# EAGLE design iya ini pcb cetaknya (EAGLE 9.6.2)
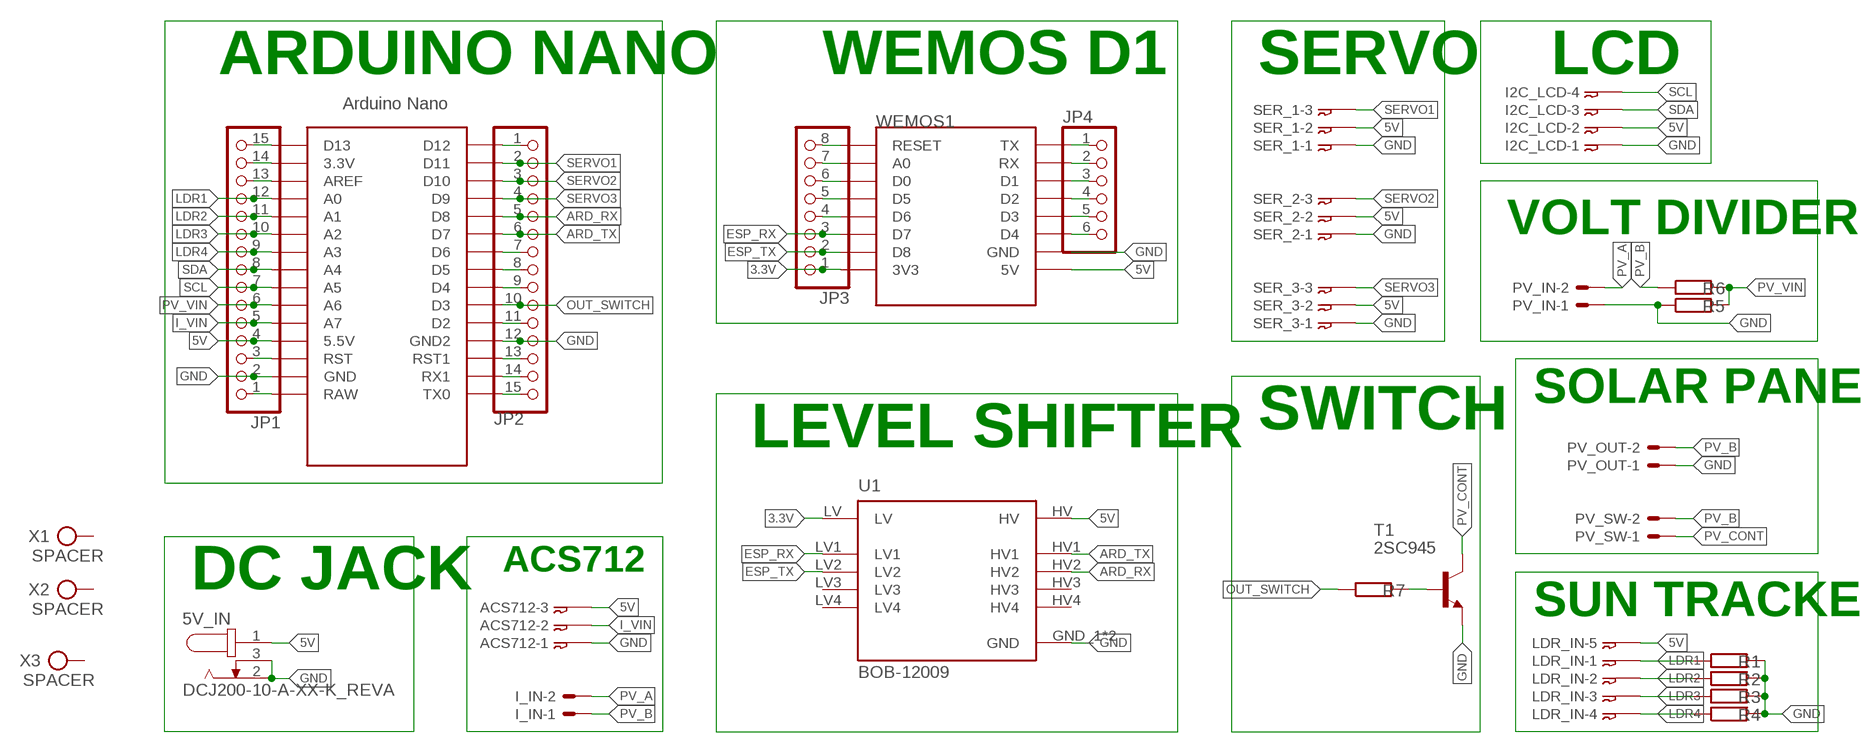
[diagram p0: schematic, sheet 1]

## Parts
5V_IN  DCJ200-10-A-XX-K_REVA  [GCT_DCJ200-10-A-XX-K_REVA]
ACS712  03-JST-B3B-XH-A  [B3B-XH]
I2C_LCD  04-JST-B4B-XH-A  [B4B-XH]
I_IN  MOLEX_2P_27-2021  [6410-02]
JP1  PINHD-1X15  [1X15]
JP2  PINHD-1X15  [1X15]
JP3  PINHD-1X8  [1X08]
JP4  PINHD-1X6  [1X06]
LDR_IN  05-JST-B5B-XH-A  [B5B-XH]
PV_IN  MOLEX_2P_27-2021  [6410-02]
PV_OUT  MOLEX_2P_27-2021  [6410-02]
PV_SW  MOLEX_2P_27-2021  [6410-02]
R1  R-EU_0207/2V  [0207/2V]
R2  R-EU_0207/2V  [0207/2V]
R3  R-EU_0207/2V  [0207/2V]
R4  R-EU_0207/2V  [0207/2V]
R5  R-EU_0207/10  [0207/10]
R6  R-EU_0207/10  [0207/10]
R7  R-EU_0207/10  [0207/10]
SER_1  03-JST-B3B-XH-A  [B3B-XH]
SER_2  03-JST-B3B-XH-A  [B3B-XH]
SER_3  03-JST-B3B-XH-A  [B3B-XH]
T1  2SC945  [TO92-ECB]
U1  BOB-12009  [CONV_BOB-12009]
U$1  NANO  [NANO]
WEMOS1  WEMOS-D1-MINI  [WEMOS-D1-MINI]
X1  SPACER  [SPACER]
X2  SPACER  [SPACER]
X3  SPACER  [SPACER]

## Nets
3.3V: JP3.1 U1.LV WEMOS1.3V3
5V: 5V_IN.1 ACS712.P$3 I2C_LCD.P$2 JP1.4 LDR_IN.P$5 SER_1.P$2 SER_2.P$2 SER_3.P$2 U1.HV U$1.5V(5.5V) WEMOS1.5V
ARD_RX: JP2.5 U1.HV2 U$1.D8
ARD_TX: JP2.6 U1.HV1 U$1.D7
ESP_RX: JP3.3 U1.LV1 WEMOS1.D7
ESP_TX: JP3.2 U1.LV2 WEMOS1.D8
GND: 5V_IN.2 5V_IN.3 ACS712.P$1 I2C_LCD.P$1 JP1.2 JP2.12 PV_IN.1 PV_OUT.1 R1.2 R2.2 R3.2 R4.2 R5.1 SER_1.P$1 SER_2.P$1 SER_3.P$1 T1.E U1.GND_1(GND) U1.GND_2(GND) U$1.GND U$1.GND1(GND2) WEMOS1.GND
I_VIN: ACS712.P$2 JP1.5 U$1.A7
LDR1: JP1.12 LDR_IN.P$1 R1.1 U$1.A0
LDR2: JP1.11 LDR_IN.P$2 R2.1 U$1.A1
LDR3: JP1.10 LDR_IN.P$3 R3.1 U$1.A2
LDR4: JP1.9 LDR_IN.P$4 R4.1 U$1.A3
N$1: JP2.7 U$1.D6
N$3: R7.2 T1.B
N$5: JP2.1 U$1.D12
N$8: JP3.8 WEMOS1.RESET
N$9: JP3.7 WEMOS1.A0
N$10: JP2.8 U$1.D5
N$11: JP2.9 U$1.D4
N$13: JP3.6 WEMOS1.D0
N$14: JP2.11 U$1.D2
N$15: JP3.5 WEMOS1.D5
N$16: JP2.13 U$1.RST1
N$17: JP2.14 U$1.RX1
N$18: JP2.15 U$1.TX0
N$19: JP1.1 U$1.RAW
N$20: JP1.3 U$1.RST
N$21: JP3.4 WEMOS1.D6
N$24: JP1.13 U$1.AREF
N$25: JP1.14 U$1.3.3V
N$26: JP1.15 U$1.D13
N$29: JP4.6 WEMOS1.D4
N$30: JP4.5 WEMOS1.D3
N$31: JP4.4 WEMOS1.D2
N$32: JP4.3 WEMOS1.D1
N$33: JP4.2 WEMOS1.RX
N$34: JP4.1 WEMOS1.TX
OUT_SWITCH: JP2.10 R7.1 U$1.D3
PV_A: I_IN.2 PV_IN.2
PV_B: I_IN.1 PV_OUT.2 PV_SW.2 R6.1
PV_CONT: PV_SW.1 T1.C
PV_VIN: JP1.6 R5.2 R6.2 U$1.A6
SCL: I2C_LCD.P$4 JP1.7 U$1.A5
SDA: I2C_LCD.P$3 JP1.8 U$1.A4
SERVO1: JP2.2 SER_1.P$3 U$1.D11
SERVO2: JP2.3 SER_2.P$3 U$1.D10
SERVO3: JP2.4 SER_3.P$3 U$1.D9
Unconnected: U1.HV3 U1.HV4 U1.LV3 U1.LV4 U$1.ICSP1 U$1.ICSP2 U$1.ICSP3 U$1.ICSP4 U$1.ICSP5 U$1.ICSP6 X1.X X2.X X3.X

## Notes on the sheet
- ARDUINO NANO | WEMOS D1 | SERVO | LCD
- VOLT DIVIDER
- SOLAR PANEL
- LEVEL SHIFTER | SWITCH
- ACS712
- DC JACK
- SUN TRACKER

## Library data of the parts
5V_IN = DCJ200-10-A-XX-K_REVA:DCJ200-10-A-XX-K_REVA: Check availability <https://pricing.snapeda.com/parts/DCJ200-10-A-K1-K/Global%20Connector%20Technology/view-part?ref=eda>; AVAILABILITY: In Stock; CHECK_PRICES: https://www.snapeda.com/parts/DCJ200-10-A-K1-K/Global+Connector+Technology/view-part/?ref=eda; DESCRIPTION: Power Barrel Connector Jack 2.05mm ID (0.081), 5.50mm OD (0.217) Through Hole, Right Angle; MF: Global Connector Technology; MP: DCJ200-10-A-K1-K; PACKAGE: None; PRICE: None; SNAPEDA_LINK: https://www.snapeda.com/parts/DCJ200-10-A-K1-K/Global+Connector+Technology/view-part/?ref=snap
ACS712 SER_1-SER_3 = bt_con-jst-xh:03-JST: JST CONNECTOR
I2C_LCD = bt_con-jst-xh:04-JST: JST CONNECTOR
I_IN PV_IN PV_OUT PV_SW = 1_Polirevo24_PelatihanElektronika:MOLEX_2P_: MOLEX 2P - POLIREVO24; MF: MOLEX; OC_FARNELL: unknown; OC_NEWARK: unknown
JP1 JP2 = pinhead:PINHD-1X15: PIN HEADER
JP3 = pinhead:PINHD-1X8: PIN HEADER
JP4 = pinhead:PINHD-1X6: PIN HEADER
LDR_IN = bt_con-jst-xh:05-JST: JST CONNECTOR
R1-R7 = resistor:R-EU_: RESISTOR, European symbol
T1 = transistor:2SC945: NPN Silicon Epitaxial Planar Transistor Source: SEMTECH ELECTRONICS LTD. ... 2SC945 2.pdf
U1 = BOB-12009:BOB-12009: Check availability <https://pricing.snapeda.com/parts/BOB-12009/SparkFun/view-part?ref=eda>; AVAILABILITY: In Stock; CHECK_PRICES: https://www.snapeda.com/parts/BOB-12009/SparkFun/view-part/?ref=eda; DESCRIPTION: BSS138 - Logic-Level Translator Interface Evaluation Board; MF: SparkFun; MP: BOB-12009; PACKAGE: None; PRICE: None; SNAPEDA_LINK: https://www.snapeda.com/parts/BOB-12009/SparkFun/view-part/?ref=snap
U$1 = Arduino-clone:NANO: Arduino Nano
WEMOS1 = Eagle Mixed Library:WEMOS-D1-MINI: WeMos.cc D1 mini ESP8266 module
X1-X3 = LIBRARY PHD SELEKDA:SPACER: Spacer PCB

## Board
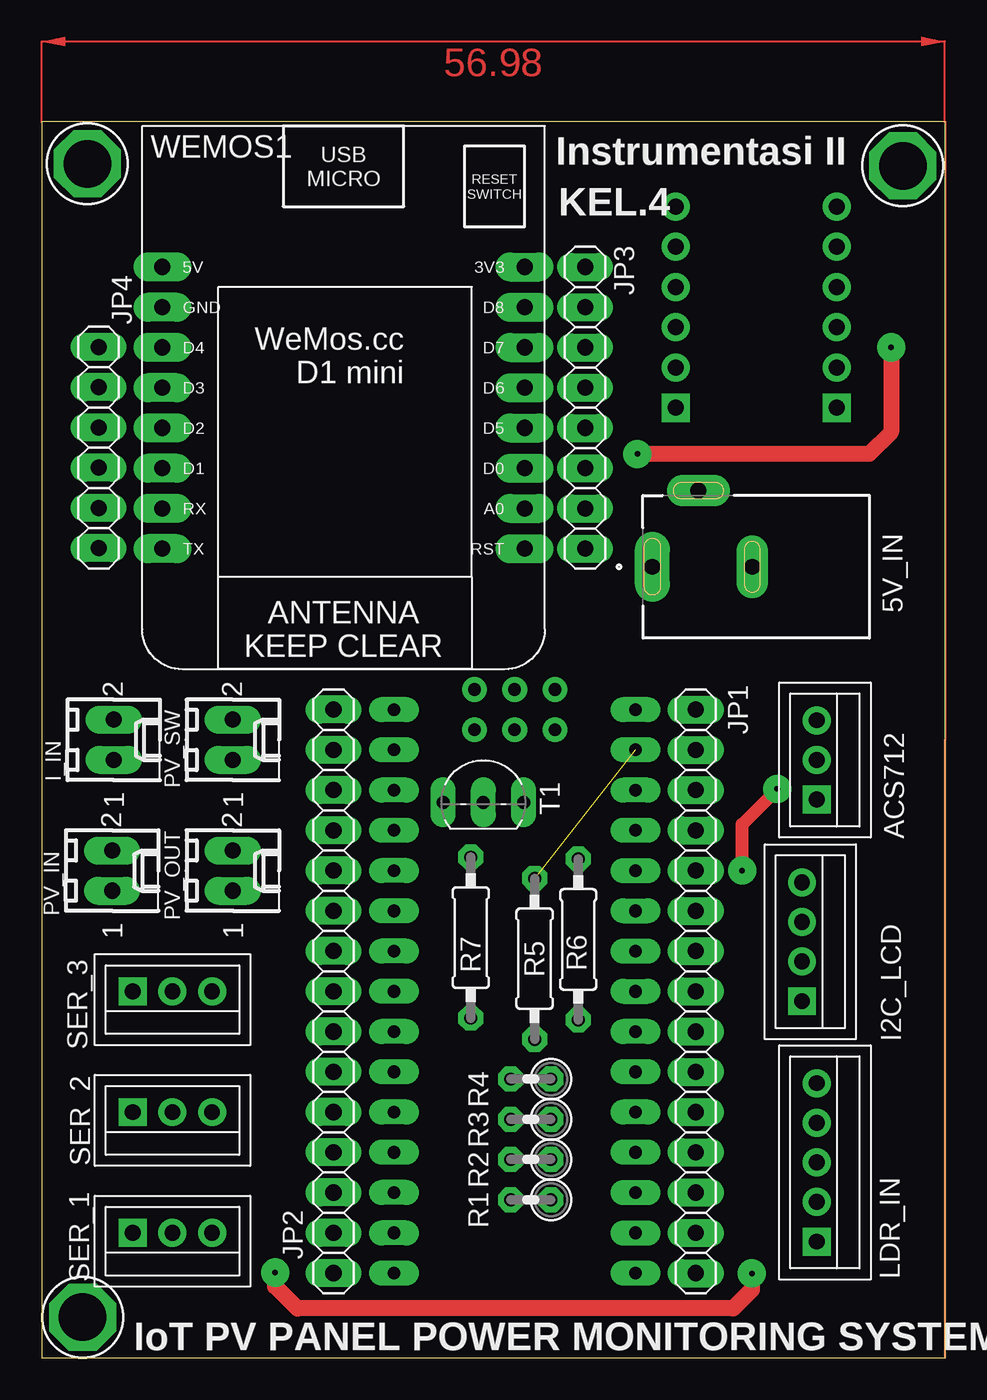
[diagram p1: board, top side]
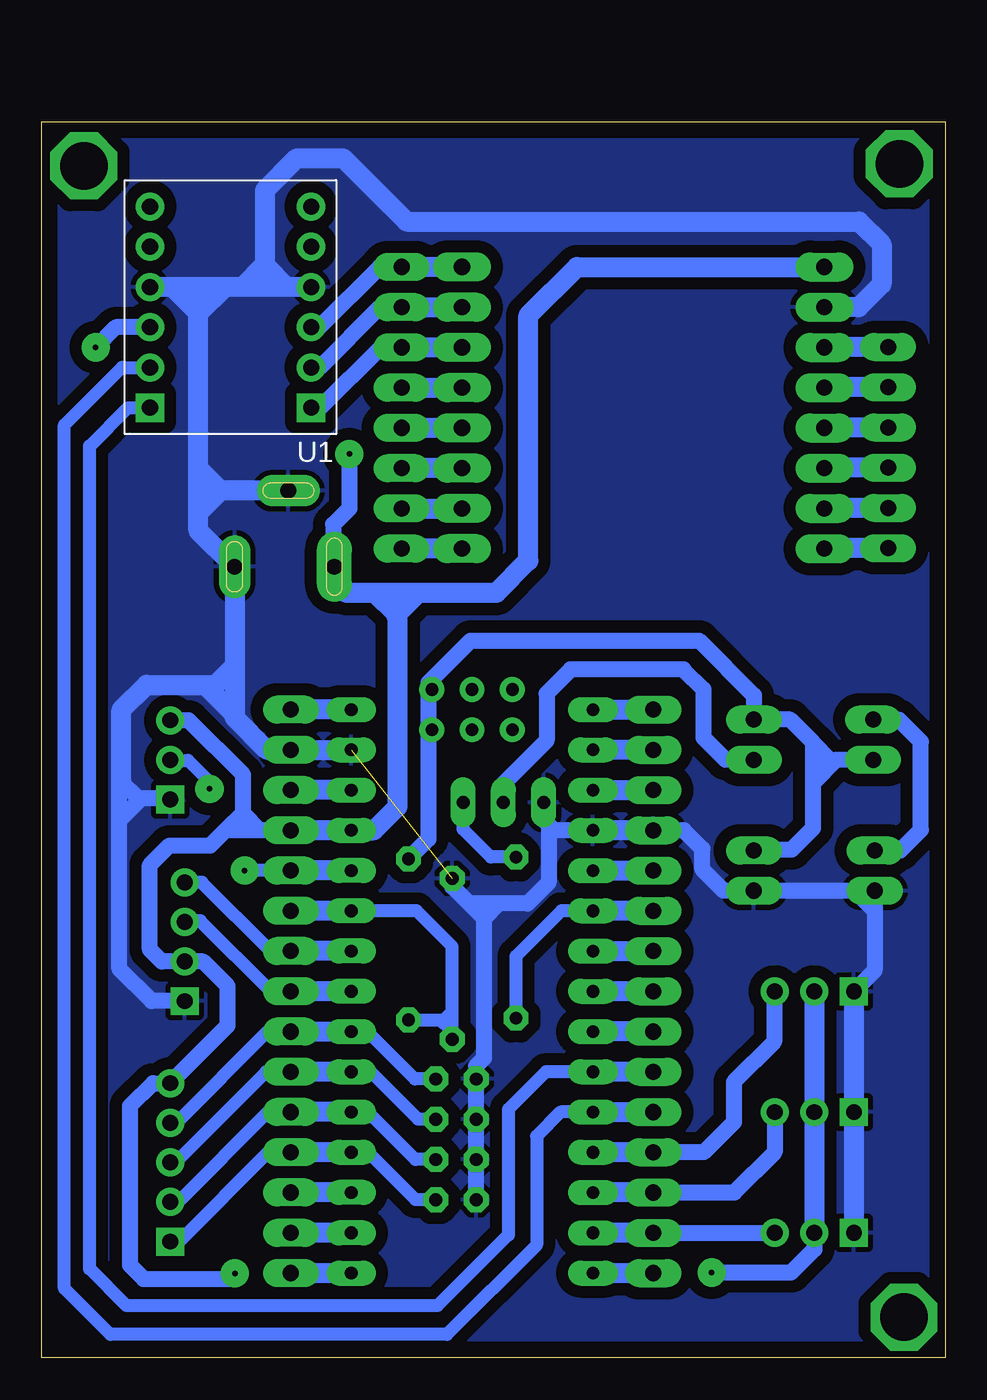
[diagram p2: board, bottom side, seen from below]

Size 57 x 78 mm. Coordinates in mm from the lower left corner, seen from the top.
Outline: 0,0 57,0 57,78 0,78 0,0
Copper layers (1*16): Top 0.035mm / dielectric 1.5mm / Bottom 0.035mm
Design rules "default *": minimum track width 6mil, minimum drill 0.35mm, track to track 30mil, track to pad 28mil, pad to pad 28mil, via to via 28mil, smd to smd 13mil, copper to edge 40mil, drill to drill 6mil, minimum pad ring 15mil, minimum via ring 28mil, stop-mask expansion 4mil, vias tented up to drill 0mil, thermal gap 13mil

### Footprints (pad centres in the part's own frame; a part is rotated, then mirrored left to right if it is on the bottom)
GCT_DCJ200-10-A-XX-K_REVA = drill 1 pad 2.2 long: 1 0,6.55 | drill 1 pad 2 long: 2 0,0.25; 3 4.8,3.65
B3B-XH = drill 1 square: P$1 2.5,0 | drill 1: P$2 0,0; P$3 -2.5,0
B4B-XH = drill 1 square: P$1 3.75,0 | drill 1: P$2 1.25,0; P$3 -1.25,0; P$4 -3.75,0
6410-02 = drill 1.016 long: 1 1.27,0; 2 -1.27,0
1X15 = drill 1.016 long: 1 -17.78,0; 2 -15.24,0; 3 -12.7,0; 4 -10.16,0; 5 -7.62,0; 6 -5.08,0; 7 -2.54,0; 8 0,0; 9 2.54,0; 10 5.08,0; 11 7.62,0; 12 10.16,0; 13 12.7,0; 14 15.24,0; 15 17.78,0
1X08 = drill 1.016 long: 1 -8.89,0; 2 -6.35,0; 3 -3.81,0; 4 -1.27,0; 5 1.27,0; 6 3.81,0; 7 6.35,0; 8 8.89,0
1X06 = drill 1.016 long: 1 -6.35,0; 2 -3.81,0; 3 -1.27,0; 4 1.27,0; 5 3.81,0; 6 6.35,0
B5B-XH = drill 1 square: P$1 5,0 | drill 1: P$2 2.5,0; P$3 0,0; P$4 -2.5,0; P$5 -5,0
0207/2V = drill 0.813 octagon: 1 -1.27,0; 2 1.27,0
0207/10 = drill 0.813 octagon: 1 -5.08,0; 2 5.08,0
TO92-ECB = drill 0.813 long: B 2.54,0; C 0,0; E -2.54,0
CONV_BOB-12009 = drill 1.016: GND_1 5.08,-1.27; GND_2 -5.08,-1.27; HV 5.08,1.27; HV2 5.08,3.81; HV3 5.08,-3.81; HV4 5.08,-6.35; LV -5.08,1.27; LV2 -5.08,3.81; LV3 -5.08,-3.81; LV4 -5.08,-6.35 | drill 1.016 square: HV1 5.08,6.35; LV1 -5.08,6.35
NANO = drill 0.8 long: 3.3V -10.16,24.13; 5V -10.16,-1.27; A0 -10.16,19.05; A1 -10.16,16.51; A2 -10.16,13.97; A3 -10.16,11.43; A4 -10.16,8.89; A5 -10.16,6.35; A6 -10.16,3.81; A7 -10.16,1.27; AREF -10.16,21.59; D2 5.08,1.27; D3 5.08,3.81; D4 5.08,6.35; D5 5.08,8.89; D6 5.08,11.43; D7 5.08,13.97; D8 5.08,16.51; D9 5.08,19.05; D10 5.08,21.59; D11 5.08,24.13; D12 5.08,26.67; D13 -10.16,26.67; GND -10.16,-6.35; GND1 5.08,-1.27; RAW -10.16,-8.89; RST -10.16,-3.81; RST1 5.08,-3.81; RX1 5.08,-6.35; TX0 5.08,-8.89 | drill 0.8: ICSP1 -5.08,-10.16; ICSP2 -5.08,-7.62; ICSP3 -2.54,-10.16; ICSP4 -2.54,-7.62; ICSP5 0,-10.16; ICSP6 0,-7.62
WEMOS-D1-MINI = drill 1.016 pad 1.829 long: 3V3 -10.16,-10.16; 5V 12.7,-10.16; A0 -10.16,5.08; D0 -10.16,2.54; D1 12.7,2.54; D2 12.7,0; D3 12.7,-2.54; D4 12.7,-5.08; D5 -10.16,0; D6 -10.16,-2.54; D7 -10.16,-5.08; D8 -10.16,-7.62; GND 12.7,-7.62; RESET -10.16,7.62; RX 12.7,5.08; TX 12.7,7.62
SPACER = drill 3 pad 4 octagon: X 0,0

### Placement (x,y rotation side)
5V_IN  45.09,49.93 90 top
ACS712  48.9,37.73 270 top
I2C_LCD  47.97,26.26 270 top
I_IN  4.55,39.01 270 top
JP1  41.27,23.13 270 top
JP2  18.41,23.13 90 top
JP3  34.29,59.96 270 top
JP4  3.6,57.45 90 top
LDR_IN  48.9,12.34 270 top
PV_IN  4.45,30.75 270 top
PV_OUT  12.06,30.75 270 top
PV_SW  12.06,39.01 270 top
R1  30.86,9.97 180 top
R2  30.86,12.51 180 top
R3  30.86,15.05 180 top
R4  30.86,17.59 180 top
R5  31.1,25.19 270 top
R6  33.86,26.41 270 top
R7  27.08,26.52 90 top
SER_1  8.26,7.89 180 top
SER_2  8.26,15.51 180 top
SER_3  8.26,23.13 180 top
T1  27.87,35.05 0 top
U1  45.09,66.31 180 bottom
U$1  27.3,32.02 180 top
WEMOS1  20.32,58.69 180 top
X1  2.59,2.56 0 top
X2  2.89,75.36 0 top
X3  54.34,75.23 0 top

### Tracks (layer width: path | path; a pad name or v marks a point on that pad's centre or on a via)
3.3V
  Bottom 1.016: JP3.1 35.69,68.85 39.5,65.04 U1.LV
  Bottom 1.27: WEMOS1.3V3 JP3.1
5V  (via drill 0.35)
  Top 1.016: v44.81,5.33 44.81,4.3 43.63,3.12 16.13,3.12 14.74,4.51 v14.74,5.38 | v53.59,63.77 53.59,58.44 52.2,57.04 v37.59,57.04
  Bottom 1.016: 45.41,33.29 46.37,32.33 48.94,32.33 50.17,31.1 50.17,25.77 49.41,25.01 I2C_LCD.P$2 46.81,25.01 45.27,23.47 45.27,20.98 48.9,17.35 LDR_IN.P$5 49.99,17.34 51.44,15.89 51.44,5.86 50.56,4.99 45.16,4.99 v44.81,5.33 | 45.41,33.29 44.3,34.4 | 44.3,34.4 44.26,34.43 44.26,34.32 | 44.3,34.4 44.3,36.81 47.73,40.23 ACS712.P$3 | JP1.4 43.23,33.29 | 43.23,33.29 44.58,33.29 | 44.58,33.29 45.41,33.29 | 44.26,34.32 44.26,33.6 44.58,33.29 | 43.23,33.29 44.26,34.32 | SER_1.P$2 8.26,6.85 9.72,5.38 v14.74,5.38 | U1.HV 52.32,65.04 v53.59,63.77 | v37.59,57.04 37.59,53.61 38.61,52.59 38.61,50 5V_IN.1
  Bottom 1.27: SER_3.P$2 SER_2.P$2 SER_1.P$2 | JP1.4 U$1.5V 36.04,33.29 34.54,34.79 34.54,46.98 | WEMOS1.5V 23.22,68.85 26.29,65.78 26.29,50.31 28.32,48.28 33.4,48.28 | 5V_IN.1 38.53,49.04 37.77,48.28 35.94,48.28 | 33.4,48.28 34.8,48.28 | 34.8,48.28 35.94,48.28 | 34.8,48.28 34.65,48.12 34.65,46.98 | 34.65,46.98 34.65,46.88 34.54,46.98 | 34.65,46.98 35.94,48.28 | 34.54,46.98 33.4,48.12 33.4,48.28
ARD_RX
  Bottom 0.813: U$1.D8 24.26,15.51 25.78,13.99 25.78,7.13 31.43,1.48 52.67,1.48 55.57,4.38 55.57,58.88 51.94,62.5 U1.HV2
  Bottom 1.27: U$1.D8 JP2.5
ARD_TX
  Bottom 0.813: U$1.D7 25.19,18.05 27.56,15.68 27.56,7.76 32.03,3.29 51.66,3.29 53.98,5.6 53.98,57.55 51.56,59.96 U1.HV1
  Bottom 1.27: JP2.6 U$1.D7
ESP_RX
  Bottom 1.016: JP3.3 35.62,63.77 39.43,59.96 U1.LV1
  Bottom 1.27: WEMOS1.D7 JP3.3
ESP_TX
  Bottom 1.016: JP3.2 35.66,66.31 39.47,62.5 U1.LV2
  Bottom 1.27: JP3.2 WEMOS1.D8
GND  (1 unrouted)
  Bottom 1.016: R1.2 R2.2 R3.2 R4.2 29.59,18.42 29.09,18.93 29.09,27.73 | I2C_LCD.P$1 50.07,22.51 52.09,24.54 52.09,33.92 | 52.09,33.92 50.72,35.29 | 50.72,35.29 48.95,35.29 ACS712.P$1 | 52.09,33.92 52.09,36.52 51.97,36.39 50.87,35.29 50.72,35.29 | 4.45,28.21 PV_IN.1 5.71,29.48 | 4.45,28.21 4.45,24.44 SER_3.P$1 | 5.71,29.48 PV_OUT.1 13.97,29.48 15.32,30.83 15.32,32.12 16.48,33.29 JP2.12 | 4.45,28.21 5.71,29.48 | T1.E 25.33,33.96 25.01,33.64 | 25.01,33.64 24.66,33.29 U$1.GND1 | 25.01,33.64 25.01,29.99 26.34,28.67 28.16,28.67 | 28.16,28.67 29.09,28.67 | 29.09,28.67 30.02,28.67 | R5.1 31.1,29.75 30.02,28.67 | 29.09,28.67 29.09,27.74 | 29.09,27.73 30.02,28.67 | 29.09,27.73 29.09,27.74 | 29.09,27.74 28.16,28.67
  Bottom 1.27: SER_3.P$1 SER_2.P$1 SER_1.P$1 | 51.97,36.39 51.97,40.89 50.37,42.48 46.06,42.48 44.84,43.7 | 44.84,40.58 46.61,42.36 | 44.84,43.7 5V_IN.2 47.12,52.21 47.12,53.31 | 44.84,43.7 44.84,40.58 | 44.84,40.58 44.84,40.41 42.79,38.37 JP1.2 U$1.GND | U1.GND_2 41.53,67.58 | 41.53,67.58 42.93,67.58 | 42.93,67.58 44.32,67.58 | 44.32,67.58 45.47,67.58 | 45.47,67.58 47.12,67.58 | 47.12,67.58 48.77,67.58 | 48.77,67.58 U1.GND_1 | 47.12,53.31 47.12,54.48 | 47.12,54.48 47.12,56.15 | 47.12,56.15 47.12,65.93 | 47.12,65.93 47.12,67.58 | 45.47,67.58 47.12,65.93 | 47.12,65.93 48.77,67.58 | 42.93,68.98 42.93,73.68 40.89,75.71 37.98,75.71 33.98,71.71 5.45,71.71 4.02,70.28 4.02,67.75 5.46,66.31 WEMOS1.GND | 42.93,68.98 42.93,67.58 | 42.93,68.98 41.53,67.58 | 42.93,68.98 44.32,67.58 | JP2.12 U$1.GND1 | 5V_IN.3 45.7,54.73 | 45.7,54.73 46.87,54.73 47.12,54.48 | 45.7,54.73 47.12,53.31 | 45.7,54.73 47.12,56.15
  pour Bottom: -0.01,77.98 -0.01,0 56.99,0 56.99,0 56.99,77.98 0.01,77.98 0.01,77.98
I_VIN  (via drill 0.35)
  Top 0.813: v44.2,30.75 44.2,33.67 46.41,35.89 v46.41,35.91
  Bottom 0.813: JP1.5 v44.2,30.75 | v46.41,35.91 46.41,36.37 47.76,37.71 48.87,37.71 ACS712.P$2
  Bottom 1.27: U$1.A7 JP1.5
LDR1
  Bottom 0.813: JP1.12 42.69,12.97 48.33,7.34 LDR_IN.P$1 | R1.1 33.41,9.97 36.41,12.97 U$1.A0
  Bottom 1.27: U$1.A0 JP1.12
LDR2
  Bottom 0.813: JP1.11 42.71,15.51 48.42,9.79 48.85,9.79 LDR_IN.P$2 | R2.1 33.43,12.51 36.42,15.51 U$1.A1
  Bottom 1.27: U$1.A1 JP1.11
LDR3
  Bottom 0.813: JP1.10 42.84,18.05 48.56,12.34 LDR_IN.P$3 | R3.1 33.25,15.05 36.25,18.05 U$1.A2
  Bottom 1.27: U$1.A2 JP1.10
LDR4
  Bottom 0.813: JP1.9 42.76,20.59 48.52,14.84 LDR_IN.P$4 | R4.1 33.45,17.59 36.45,20.59 U$1.A3
  Bottom 1.27: JP1.9 U$1.A3
N$1
  Bottom 1.27: JP2.7 U$1.D6
N$3
  Bottom 0.813: R7.2 28.66,31.6 30.41,33.35 T1.B
N$5
  Bottom 1.27: JP2.1 U$1.D12
N$8
  Bottom 1.27: WEMOS1.RESET JP3.8
N$9
  Bottom 1.27: JP3.7 WEMOS1.A0
N$10
  Bottom 1.27: JP2.8 U$1.D5
N$11
  Bottom 1.27: U$1.D4 JP2.9
N$13
  Bottom 1.27: WEMOS1.D0 JP3.6
N$14
  Bottom 1.27: U$1.D2 JP2.11
N$15
  Bottom 1.27: WEMOS1.D5 JP3.5
N$16
  Bottom 1.27: U$1.RST1 JP2.13
N$17
  Bottom 1.27: JP2.14 U$1.RX1
N$18
  Bottom 1.27: U$1.TX0 JP2.15
N$19
  Bottom 1.27: U$1.RAW JP1.1
N$20
  Bottom 1.27: U$1.RST JP1.3
N$21
  Bottom 1.27: JP3.4 WEMOS1.D6
N$24
  Bottom 1.27: U$1.AREF JP1.13
N$25
  Bottom 1.27: U$1.3.3V JP1.14
N$26
  Bottom 1.27: U$1.D13 JP1.15
N$29
  Bottom 1.27: JP4.6 7.59,63.8 WEMOS1.D4
N$30
  Bottom 1.27: JP4.5 7.59,61.26 WEMOS1.D3
N$31
  Bottom 1.27: JP4.4 7.59,58.72 WEMOS1.D2
N$32
  Bottom 1.27: JP4.3 7.59,56.18 WEMOS1.D1
N$33
  Bottom 1.27: JP4.2 7.59,53.64 WEMOS1.RX
N$34
  Bottom 1.27: JP4.1 7.59,51.1 WEMOS1.TX
OUT_SWITCH
  Bottom 0.813: U$1.D3 24.21,28.21 27.08,25.34 R7.1
  Bottom 1.27: JP2.10 U$1.D3
PV_A
  Bottom 1.016: PV_IN.2 2.85,32.02 1.53,33.33 1.53,38.89 2.92,40.27 I_IN.2
PV_B
  Bottom 1.016: 8.33,36.26 8.33,33.44 9.69,32.08 12,32.08 PV_OUT.2 | 8.33,36.26 8.33,37.68 | 8.33,37.68 8.33,38.83 | 8.33,38.83 9.78,40.27 PV_SW.2 12.06,41.81 15.52,45.26 29.94,45.26 32.6,42.6 32.6,32.74 R6.1 | I_IN.1 6.86,37.73 | 7.24,37.73 8.28,37.73 8.33,37.68 | 7.24,37.73 6.86,37.73 | 6.86,37.73 8.33,36.26 | 8.33,38.83 7.24,37.73
PV_CONT
  Bottom 1.016: PV_SW.1 13.84,37.73 15.24,39.13 15.24,42.18 16.51,43.45 23.62,43.45 25.15,41.93 25.15,38.96 27.87,36.23 T1.C
PV_VIN
  Bottom 0.813: R5.2 31.1,20.59 | 31.1,20.59 31.1,21.35 | 31.1,21.35 31.1,21.86 | 31.1,21.86 31.1,25.96 33.35,28.21 U$1.A6 | R6.2 31.64,21.33 | 31.64,21.33 31.13,21.33 31.1,21.35 | 31.1,21.86 31.64,21.33 | 31.64,21.33 31.64,21.12 31.1,20.59
  Bottom 1.27: U$1.A6 JP1.6
SCL
  Bottom 0.813: JP1.7 42.55,25.67 46.89,30.01 I2C_LCD.P$4 | I2C_LCD.P$4
  Bottom 1.27: U$1.A5 JP1.7
SDA
  Bottom 0.813: JP1.8 41.32,23.09 42.5,23.09 46.99,27.58 47.91,27.58 I2C_LCD.P$3 | JP1.8
  Bottom 1.27: U$1.A4 JP1.8
SERVO1
  Bottom 1.016: JP2.2 SER_1.P$3
  Bottom 1.27: JP2.2 U$1.D11
SERVO2
  Bottom 1.016: JP2.3 13.29,10.43 10.76,12.97 SER_2.P$3
  Bottom 1.27: JP2.3 U$1.D10
SERVO3
  Bottom 1.016: SER_3.P$3 10.79,23.09 10.79,19.95 13.34,17.41 13.34,14.88 15.24,12.97 JP2.4
  Bottom 1.27: JP2.4 U$1.D9
(copper drawn outside any net)
  shapes: Top area x2

### Text on the board
tNames: Instrumentasi II | KEL.4 | LDR_IN | IoT PV PANEL POWER MONITORING SYSTEM